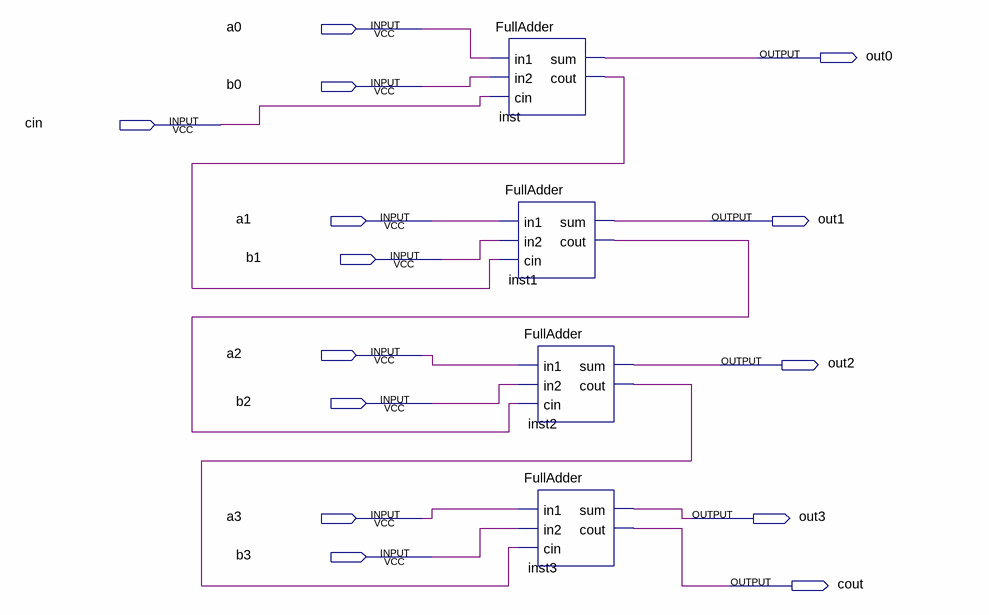
[diagram p0: schematic sheet]
// Quartus schematic fourbitadder.bdf as structural Verilog: 4 symbols, 14 pins
module fourbitadder (
  input  a0,
  input  b0,
  input  cin,
  input  a1,
  input  b1,
  input  a2,
  input  b2,
  input  a3,
  input  b3,
  output out0,
  output out1,
  output out2,
  output out3,
  output cout
);

  wire inst1_cout, inst2_cout, inst_cout;

  FullAdder inst (.in1(a0), .in2(b0), .cin(cin), .sum(out0), .cout(inst_cout));
  FullAdder inst1 (.in1(a1), .in2(b1), .cin(inst_cout), .sum(out1), .cout(inst1_cout));
  FullAdder inst2 (.in1(a2), .in2(b2), .cin(inst1_cout), .sum(out2), .cout(inst2_cout));
  FullAdder inst3 (.in1(a3), .in2(b3), .cin(inst2_cout), .sum(out3), .cout(cout));
endmodule
